# EasyEDA Pro project pcb工程文件.epro, schematic _sensor-1
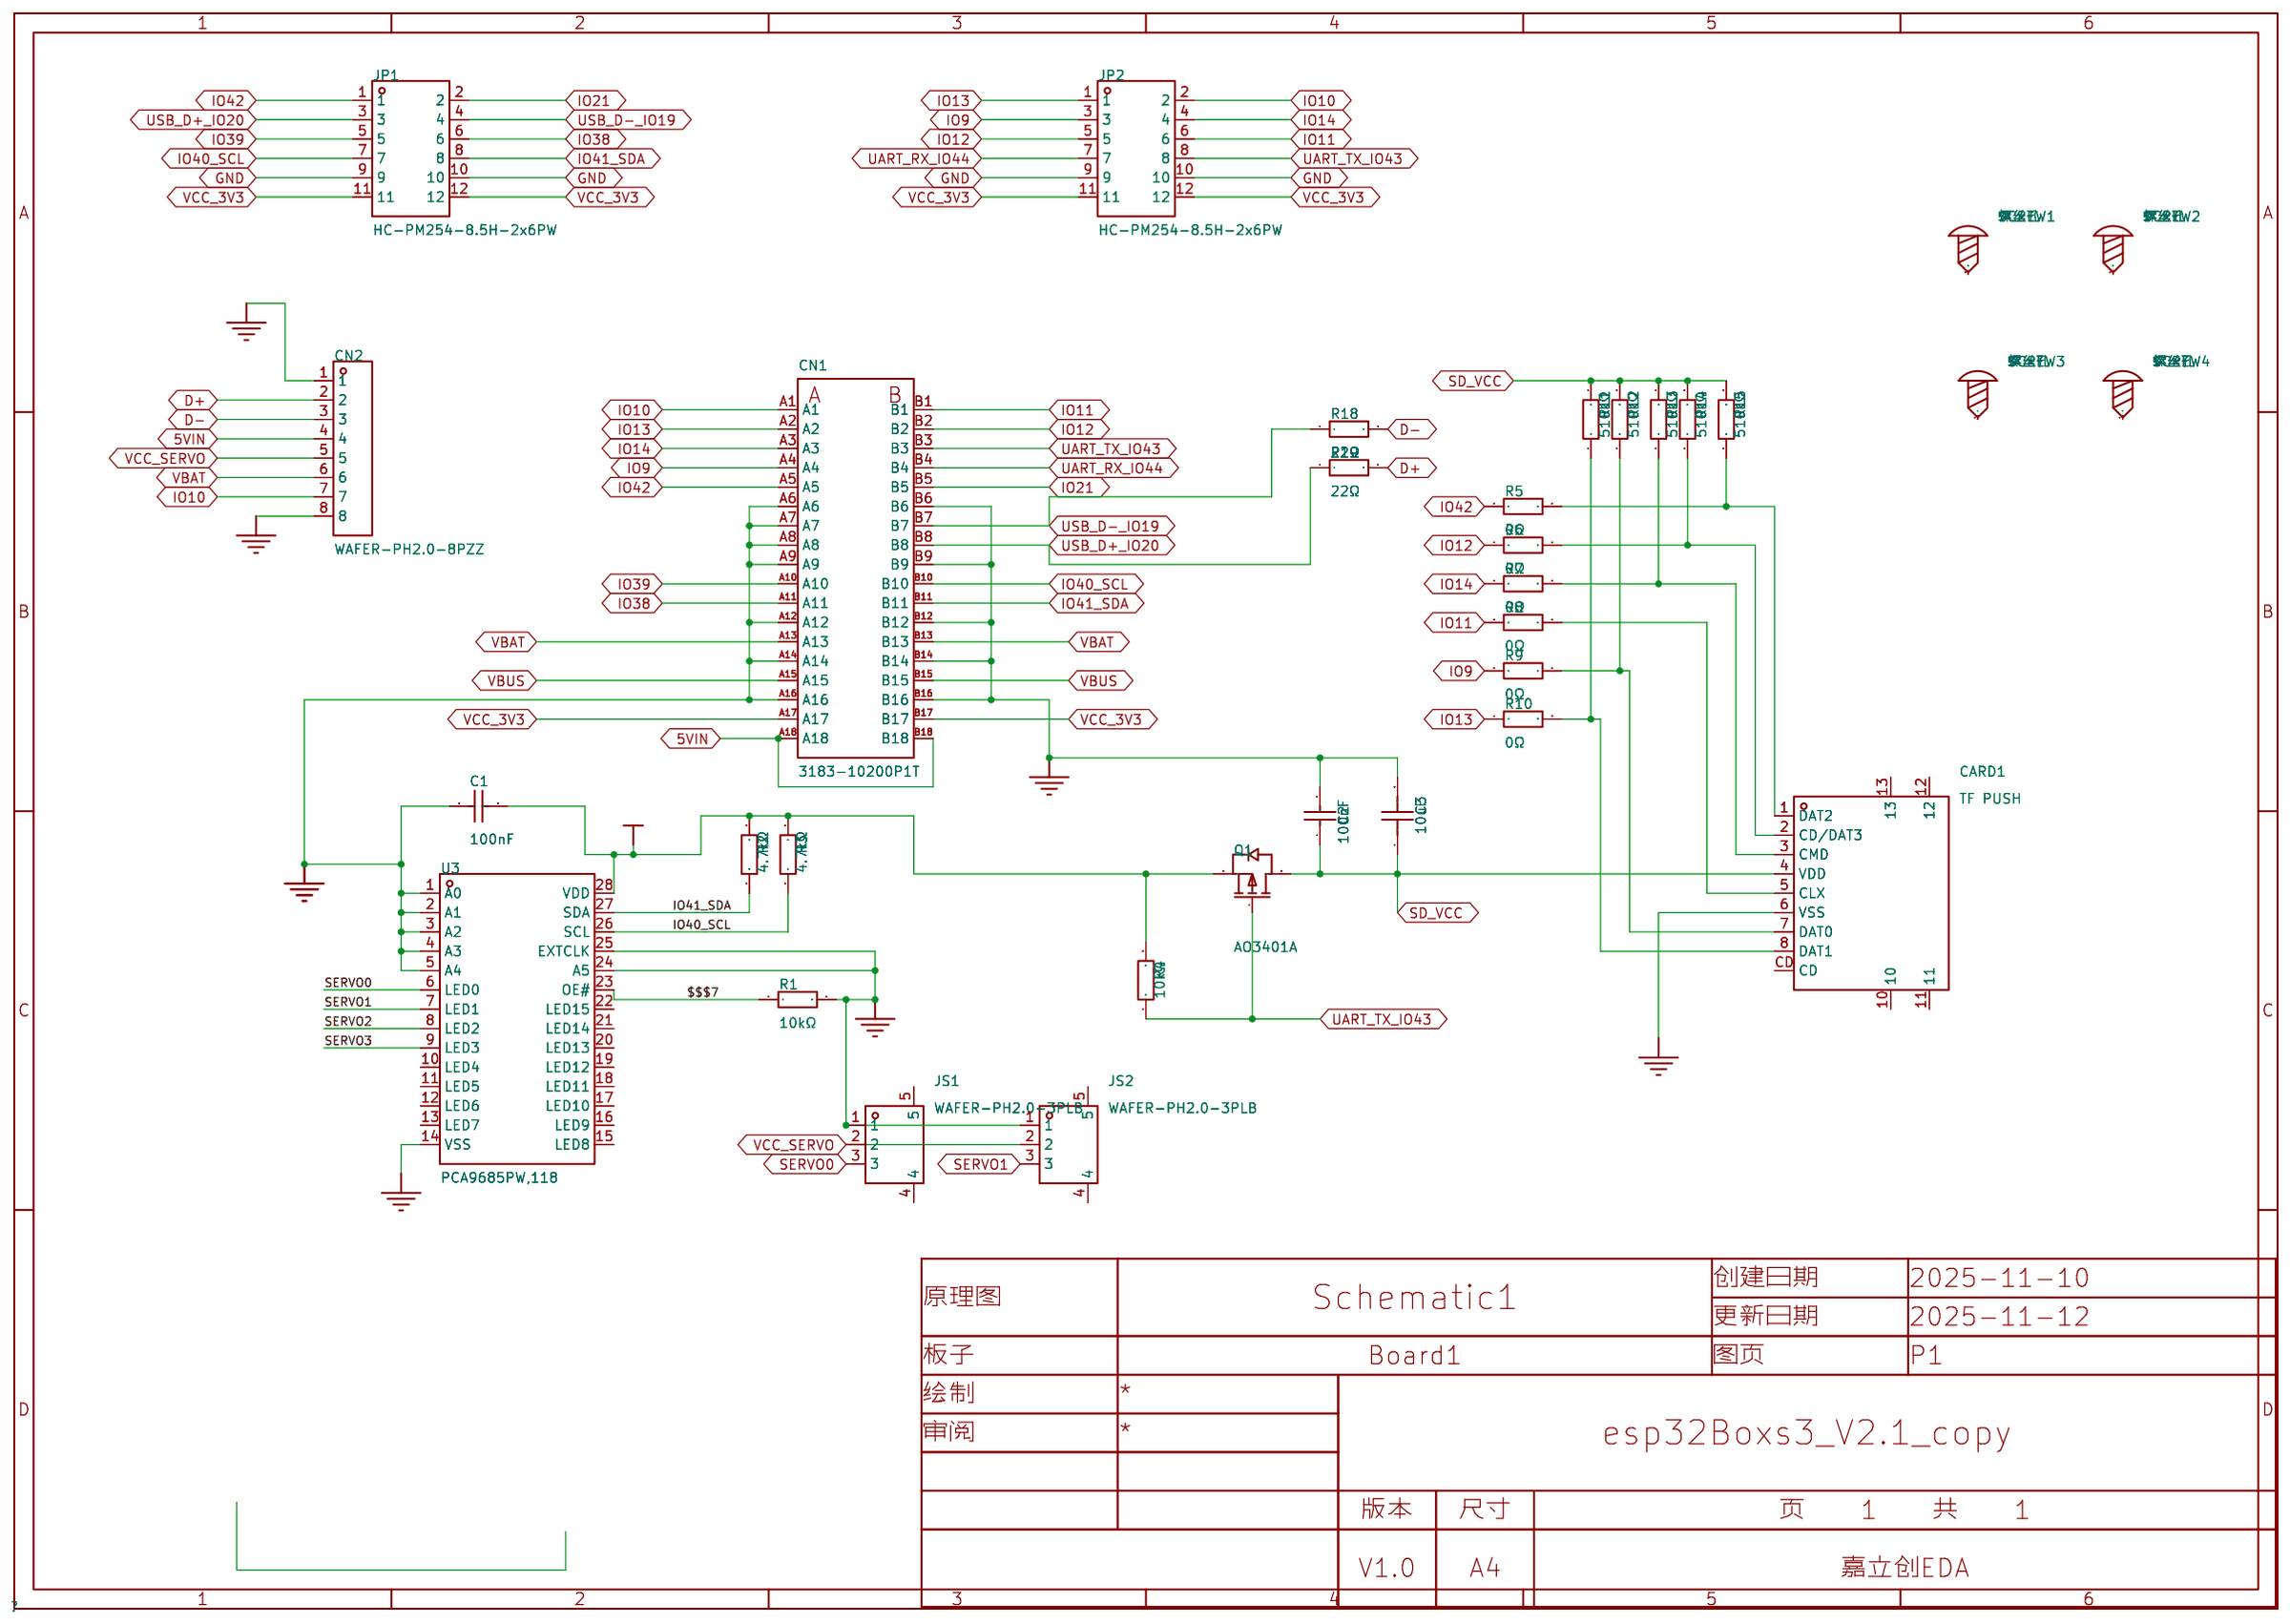
[diagram p0: schematic sheet]

## Parts
C1  100nF  [C0805]
C2  100nF  [C0805]
C3  10uF  [C0603]
CARD1  TF PUSH  [TF-SMD_TF-PUSH]
CN1  3183-10200P1T  [CONN-TH_36P-P1.00-V_3183-XXXXXPXT]
CN2  WAFER-PH2.0-8PZZ  [CONN-TH_8P-P2.00_HDGC2001WV-8P]
JP1  HC-PM254-8.5H-2x6PW  [CONN-TH_HC-PM254-8.5H-2X6PW]
JP2  HC-PM254-8.5H-2x6PW  [CONN-TH_HC-PM254-8.5H-2X6PW]
JS1  WAFER-PH2.0-3PLB  [CONN-SMD_3P-P2.00_XUNPU_WAFER-PH2.0-3PLB]
JS2  WAFER-PH2.0-3PLB  [CONN-SMD_3P-P2.00_XUNPU_WAFER-PH2.0-3PLB]
Q1  AO3401A  [SOT-23_L2.9-W1.3-P1.90-LS2.4-BR]
R1  10kΩ  [R0805]
R2  4.7kΩ  [R0805]
R3  4.7kΩ  [R0805]
R4  10kΩ  [R0603]
R5  0Ω  [R0603]
R6  0Ω  [R0603]
R7  0Ω  [R0603]
R8  0Ω  [R0603]
R9  0Ω  [R0603]
R10  0Ω  [R0603]
R11  510kΩ  [R0603]
R12  510kΩ  [R0603]
R13  510kΩ  [R0603]
R14  510kΩ  [R0603]
R15  510kΩ  [R0603]
R18  22Ω  [R0603]
R19  22Ω  [R0603]
SCREW1  螺丝孔  [M2螺丝]
SCREW2  螺丝孔  [M2螺丝]
SCREW3  螺丝孔  [M2螺丝]
SCREW4  螺丝孔  [M2螺丝]
U3  PCA9685PW,118  [TSSOP-28_L9.7-W4.4-P0.65-LS6.4-TL]

## Library data of the parts
C1 C2 = CL21B104KBCNNNC: 容值:100nF;精度:±10%;额定电压:50V;温度系数:X7R;; LCSC Part Name: 100nF ±10% 50V; Supplier Part: C1711; Manufacturer: SAMSUNG(三星); Supplier Footprint: 0805; JLCPCB Part Class: 扩展库; Datasheet: https://item.szlcsc.com/datasheet/CL21B104KBCNNNC/2063.html; Supplier: LCSC; Tolerance: ±10%; Voltage Rating: 50V; Temperature Coefficient: X7R
C3 = CL10A106KP8NNNC: 容值:10uF;精度:±10%;额定电压:10V;温度系数:X5R;; LCSC Part Name: 10uF ±10% 10V; Supplier Part: C19702; Manufacturer: SAMSUNG(三星); Supplier Footprint: 0603; JLCPCB Part Class: 基础库; Datasheet: https://item.szlcsc.com/datasheet/CL10A106KP8NNNC/20411.html; Supplier: LCSC; Tolerance: ±10%; Voltage Rating: 10V; Temperature Coefficient: X5R
CARD1 = TF_PUSH: 卡连接方式:自弹式;卡类型:MicroSD卡(TF卡);连接器类型:卡座;本体最大高度:2mm;工作温度:-25℃~+90℃;; LCSC Part Name: 自弹式 MicroSD卡(TF卡) 卡座; Supplier Part: C393941; Manufacturer: SHOU HAN(首韩); Supplier Footprint: SMD; JLCPCB Part Class: 扩展库; Datasheet: https://item.szlcsc.com/datasheet/TF%2520PUSH/372553.html; Supplier: LCSC; Card Connection Mode: 自弹式; Card Type: MicroSD卡(TF卡); Connector Type: 卡座; Additional Card Detection Pins: 无; Height Above Board: 2mm; Operating Temperature: -25℃~+90℃
CN1 = 3183-10200P1T: PCIE3.0 DIP连接器 带双定位柱 卡边缘插座 2.3mm引脚长,PA46; LCSC Part Name: 黑色 PCIE3.0 DIP连接器 带双定位柱 卡边缘插座 2.3mm引脚长,PA46; Supplier Part: C404113; Manufacturer: UMaxconn(友贸); Supplier Footprint: 插件,P=1mm; JLCPCB Part Class: 扩展库; Datasheet: https://atta.szlcsc.com/upload/public/pdf/source/20221109/DBCA7DEED61952BFBF0AC75AC3B44CB1.pdf; Supplier: LCSC; Number of Pins: 36P; Number of Data Pins: 142P; Mounting Type: 直插; Versions: PCI-E 3.0; Height Above Board: 11.25mm; Supplementary Features: 带柱; Operating Temperature: -40℃~+85℃
CN2 = WAFER-PH2.0-8PZZ: 插针结构:1x8P;间距:2mm;安装方式:直插;参考系列:PH;总PIN数:8P;排数:1;每排PIN数:8;行距:-;额定电流:2A;触头材质:黄铜;触头镀层:锡;工作温度:-25℃~+85℃;; LCSC Part Name: 1x8P 间距:2mm 直插 系列:PH; Supplier Part: C5359605; Manufacturer: XUNPU(讯普); Supplier Footprint: 插件,P=2mm; JLCPCB Part Class: 扩展库; Datasheet: https://atta.szlcsc.com/upload/public/pdf/source/20241108/09B74E94153224768C62B7F095CB8C18.pdf; Supplier: LCSC; Pins Structure: 1x8P; Pitch: 2mm; Mounting Type: 直插; Reference Series: PH; Number of Pins: 8P; Number of Rows: 1; Number of PINs Per Row: 8; Current Rating: 2A; Contact Material: 黄铜; Contact Plating: 锡; Operating Temperature: -25℃~+85℃; Voltage Rating: 250V; Plastic Material: PA66; Flame Retardant Rating: UL94V-0; Color: 白色; Z-Height of the Board: 6.05mm; X-Length of Bottom Edge on Board (Spacing Line): 18mm; Y-Width of Bottom Edge on Board: 4.7mm
JP1 JP2 = HC-PM254-8.5H-2X6PW: 插孔结构:2x6P;间距:2.54mm;行距:2.54mm;圆孔/方孔:方孔;安装方式:弯插;排数:双排;总孔位数:12P;额定电流:3A;额定电压:-;插孔方向:侧面;塑高:5mm;触头材质:黄铜;触头镀层:金;工作温度:-40℃~+105℃;; LCSC Part Name: 间距2.54mm 2x6Pin 弯插 PC3.2 PB12.7 H8.5; Supplier Part: C22373932; Manufacturer: HC(虹成电子); Supplier Footprint: 弯插,P=2.54mm; JLCPCB Part Class: 扩展库; Datasheet: https://item.szlcsc.com/datasheet/HC-PM254-8.5H-2x6PW/23870269.html; Supplier: LCSC; Holes Structure: 2x6P; Pitch: 2.54mm; Row Spacing: 2.54mm; Circular Hole / Square Hole: 方孔; Mounting Type: 弯插; Number of Rows: 双排; Number of Positions: 12P; Current Rating: 3A; Holes Direction: 侧面; Insulation Height: 5mm; Contact Material: 黄铜; Contact Plating: 金; Operating Temperature: -40℃~+105℃; PIN Length: 3mm
JS1 JS2 = WAFER-PH2.0-3PLB: 插针结构:1x3P;间距:2mm;安装方式:立贴;参考系列:PH;总PIN数:3P;排数:1;每排PIN数:3;行距:-;额定电流:2A;触头材质:黄铜;触头镀层:锡;工作温度:-25℃~+85℃;; LCSC Part Name: 1x3P 间距:2mm 立贴 系列:PH; Supplier Part: C3029432; Manufacturer: XUNPU(讯普); Supplier Footprint: SMD,P=2mm; JLCPCB Part Class: 扩展库; Datasheet: https://item.szlcsc.com/datasheet/WAFER-PH2.0-3PLB/3561444.html; Supplier: LCSC; Pins Structure: 1x3P; Pitch: 2mm; Mounting Type: 立贴; Reference Series: PH; Number of Pins: 3P; Number of Rows: 1; Number of PINs Per Row: 3; Current Rating: 2A; Contact Material: 黄铜; Contact Plating: 锡; Operating Temperature: -25℃~+85℃; Voltage Rating: 250V; Plastic Material: LCP; Supplementary Features: 辅助焊脚; Color: 米色; Z-Height of the Board: 6.2mm; X-Length of Bottom Edge on Board (Spacing Line): 10mm; Y-Width of Bottom Edge on Board: 5.45mm
Q1 = AO3401A_C347476: 数量:1个P沟道;漏源电压(Vdss):30V;连续漏极电流(Id):4.2A;导通电阻(RDS(on)):50mΩ@10V;耗散功率(Pd):1.4W;阈值电压(Vgs(th)):1.3V@250uA;; LCSC Part Name: 1个P沟道 耐压:30V 电流:4.2A; Supplier Part: C347476; Manufacturer: UMW(友台半导体); Supplier Footprint: SOT-23; JLCPCB Part Class: 扩展库; Datasheet: https://item.szlcsc.com/datasheet/AO3401A/324136.html; Supplier: LCSC; Number: 1个P沟道; Drain to Source Voltage: 30V; Current - Continuous Drain(Id): 4.2A; RDS(on): 50mΩ@10V; Pd - Power Dissipation: 1.4W; Gate Threshold Voltage (Vgs(th)): 1.3V@250uA; Gate Charge(Qg): 9.4nC@4.5V; Input Capacitance(Ciss): 954pF; Reverse Transfer Capacitance (Crss@Vds): 77pF; Operating Temperature: -55℃~+150℃; Type: P沟道; Output Capacitance(Coss): 115pF
R1 = 0805W8F1002T5E: 电阻类型:厚膜电阻;阻值:10kΩ;精度:±1%;功率:125mW;工作电压:150V;温度系数:±100ppm/℃;; LCSC Part Name: 10kΩ ±1% 125mW 厚膜电阻; Supplier Part: C17414; Manufacturer: UNI-ROYAL(厚声); Supplier Footprint: 0805; JLCPCB Part Class: 基础库; Datasheet: https://item.szlcsc.com/datasheet/0805W8F1002T5E/18102.html; Supplier: LCSC; Type: 厚膜电阻; Tolerance: ±1%; Power(Watts): 125mW; Voltage-Supply(Max): 150V; Temperature Coefficient: ±100ppm/℃; Operating Temperature: -55℃~+155℃
R2 R3 = 0805W8F4701T5E: 电阻类型:厚膜电阻;阻值:4.7kΩ;精度:±1%;功率:125mW;最大工作电压:150V;温度系数:±100ppm/℃;; LCSC Part Name: 4.7kΩ ±1% 125mW 厚膜电阻; Supplier Part: C17673; Manufacturer: UNI-ROYAL(厚声); Supplier Footprint: 0805; JLCPCB Part Class: 基础库; Datasheet: https://atta.szlcsc.com/upload/public/pdf/source/20200306/C422600_1E6D84923E4A46A82E41ADD87F860B5C.pdf; Supplier: LCSC; Type: 厚膜电阻; Tolerance: ±1%; Power(Watts): 125mW; Overload Voltage (Max): 150V; Temperature Coefficient: ±100ppm/℃; Operating Temperature Range: -55℃~+155℃
R4 = 0603WAF1002T5E: 电阻类型:厚膜电阻;阻值:10kΩ;精度:±1%;功率:100mW;工作电压:75V;温度系数:±100ppm/℃;; LCSC Part Name: 厚膜电阻 10kΩ ±1% 100mW; Supplier Part: C25804; Manufacturer: UNI-ROYAL(厚声); Supplier Footprint: 0603; JLCPCB Part Class: 基础库; Datasheet: https://item.szlcsc.com/datasheet/0603WAF1002T5E/26547.html; Supplier: LCSC; Type: 厚膜电阻; Tolerance: ±1%; Power(Watts): 100mW; Voltage-Supply(Max): 75V; Temperature Coefficient: ±100ppm/℃; Operating Temperature: -55℃~+155℃
R5-R10 = 0603WAF0000T5E: 电阻类型:厚膜电阻;阻值:0Ω;精度:±1%;功率:100mW;工作电压:75V;温度系数:-;; LCSC Part Name: 0Ω ±1% 100mW 厚膜电阻; Supplier Part: C21189; Manufacturer: UNI-ROYAL(厚声); Supplier Footprint: 0603; JLCPCB Part Class: 基础库; Datasheet: https://item.szlcsc.com/datasheet/0603WAF0000T5E/21903.html; Supplier: LCSC; Type: 厚膜电阻; Tolerance: ±1%; Power(Watts): 100mW; Voltage-Supply(Max): 75V; Operating Temperature: -55℃~+155℃
R11-R15 = 0603WAF5103T5E: 电阻类型:厚膜电阻;阻值:510kΩ;精度:±1%;功率:100mW;工作电压:75V;温度系数:±100ppm/℃;; LCSC Part Name: 510kΩ ±1% 100mW 厚膜电阻; Supplier Part: C23192; Manufacturer: UNI-ROYAL(厚声); Supplier Footprint: 0603; JLCPCB Part Class: 基础库; Datasheet: https://item.szlcsc.com/datasheet/0603WAF5103T5E/23919.html; Supplier: LCSC; Type: 厚膜电阻; Tolerance: ±1%; Power(Watts): 100mW; Voltage-Supply(Max): 75V; Temperature Coefficient: ±100ppm/℃; Operating Temperature: -55℃~+155℃
R18 R19 = 0603WAF220JT5E: 电阻类型:厚膜电阻;阻值:22Ω;精度:±1%;功率:100mW;最大工作电压:75V;温度系数:±100ppm/℃;; LCSC Part Name: 22Ω ±1% 100mW 厚膜电阻; Supplier Part: C23345; Manufacturer: UNI-ROYAL(厚声); Supplier Footprint: 0603; JLCPCB Part Class: 基础库; Datasheet: https://atta.szlcsc.com/upload/public/pdf/source/20200306/C422600_1E6D84923E4A46A82E41ADD87F860B5C.pdf; Supplier: LCSC; Type: 厚膜电阻; Tolerance: ±1%; Power(Watts): 100mW; Overload Voltage (Max): 75V; Temperature Coefficient: ±100ppm/℃; Operating Temperature Range: -55℃~+155℃
SCREW1-SCREW4 = 螺丝孔: Supplier Footprint: 插件
U3 = PCA9685PW,118: 类型:-;工作电压(DC):2.3V~5.5V;开关频率:100kHz~1MHz;通道数:16;输出电压:-;输出电流:25mA;调光:PWM;; LCSC Part Name: 16通道、12位PWM Fm+ I2C总线LED控制器; Supplier Part: C2678753; Manufacturer: NXP(恩智浦); Supplier Footprint: TSSOP-28; JLCPCB Part Class: 扩展库; Datasheet: https://www.nxp.com.cn/docs/en/data-sheet/PCA9685.pdf; Supplier: LCSC; Voltage - Input(DC): 2.3V~5.5V; Frequency - Switching: 100kHz~1MHz; Number of Channels: 16; Output Current: 25mA; Dimming: PWM; Operating temperature: -40℃~+85℃

## Nets
5VIN: CN1.A18 CN1.B18 CN2.4
GND: C1.1 C2.2 C3.2 CARD1.6(VSS) CN1.A6 CN1.A7 CN1.A8 CN1.A9 CN1.A12 CN1.A14 CN1.A16 CN1.B6 CN1.B9 CN1.B12 CN1.B14 CN1.B16 CN2.1 CN2.8 JP1.9 JP1.10 JP2.9 JP2.10 JS1.1 JS2.1 R1.2 U3.1(A0) U3.2(A1) U3.3(A2) U3.4(A3) U3.5(A4) U3.14(VSS) U3.24(A5) U3.25(EXTCLK)
VBAT: CN1.A13 CN1.B13 CN2.6
VBUS: CN1.A15 CN1.B15
VCC_3V3: C1.2 CN1.A17 CN1.B17 JP1.11 JP1.12 JP2.11 JP2.12 Q1.2(S) R2.2 R3.2 R4.2 U3.28(VDD)
VCC_SERVO: CN2.5 JS1.2 JS2.2
$$$2: CARD1.8(DAT1) R10.2 R11.1
$$$3: CARD1.7(DAT0) R9.2 R12.1
$$$4: CARD1.3(CMD) R7.2 R13.1
$$$5: CARD1.2(CD/DAT3) R6.2 R14.1
$$$6: CARD1.1(DAT2) R5.2 R15.1
$$$7: R1.1 U3.23(OE#)
$$$8: CARD1.5(CLX) R8.2
D+: CN2.2 R19.2
D-: CN2.3 R18.2
IO9: CN1.A4 JP2.3 R9.1
IO10: CN1.A1 CN2.7 JP2.2
IO11: CN1.B1 JP2.6 R8.1
IO12: CN1.B2 JP2.5 R6.1
IO13: CN1.A2 JP2.1 R10.1
IO14: CN1.A3 JP2.4 R7.1
IO21: CN1.B5 JP1.2
IO38: CN1.A11 JP1.6
IO39: CN1.A10 JP1.5
IO40_SCL: CN1.B10 JP1.7 R3.1 U3.26(SCL)
IO41_SDA: CN1.B11 JP1.8 R2.1 U3.27(SDA)
IO42: CN1.A5 JP1.1 R5.1
SD_VCC: C2.1 C3.1 CARD1.4(VDD) Q1.3(D) R11.2 R12.2 R13.2 R14.2 R15.2
SERVO0: JS1.3 U3.6(LED0)
SERVO1: JS2.3 U3.7(LED1)
SERVO2: U3.8(LED2)
SERVO3: U3.9(LED3)
UART_RX_IO44: CN1.B4 JP2.7
UART_TX_IO43: CN1.B3 JP2.8 Q1.1(G) R4.1
USB_D+_IO20: CN1.B8 JP1.3 R19.1
USB_D-_IO19: CN1.B7 JP1.4 R18.1

Not connected (* = marked no-connect by the designer): CARD1 10 11 12 13 CD; JS1 4 5; JS2 4 5; SCREW1 1; SCREW2 1; SCREW3 1; SCREW4 1; U3 10(LED4) 11(LED5) 12(LED6) 13(LED7) 15(LED8) 16(LED9) 17(LED10) 18(LED11) 19(LED12) 20(LED13) 21(LED14) 22(LED15)
